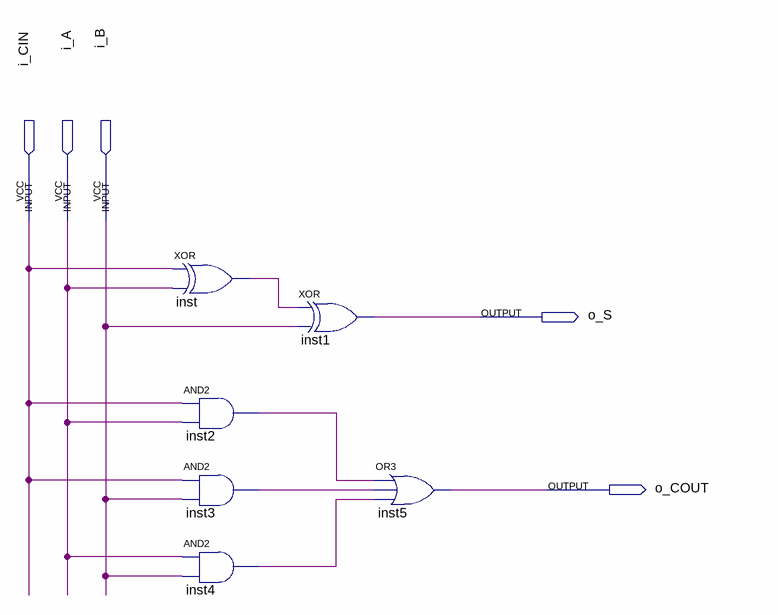
[diagram p0: schematic sheet]
// Quartus schematic full_adder.bdf as structural Verilog: 6 symbols, 5 pins
module full_adder (
  input  i_CIN,
  input  i_A,
  input  i_B,
  output o_S,
  output o_COUT
);

  wire inst2_out, inst3_out, inst4_out, inst_out;

  xor inst (inst_out, i_CIN, i_A);
  and inst2 (inst2_out, i_CIN, i_A);
  and inst3 (inst3_out, i_CIN, i_B);
  and inst4 (inst4_out, i_A, i_B);
  xor inst1 (o_S, inst_out, i_B);
  or inst5 (o_COUT, inst2_out, inst3_out, inst4_out);
endmodule
